# EAGLE design PGTN034_quantizer_mki_controls (EAGLE 9.6.0)
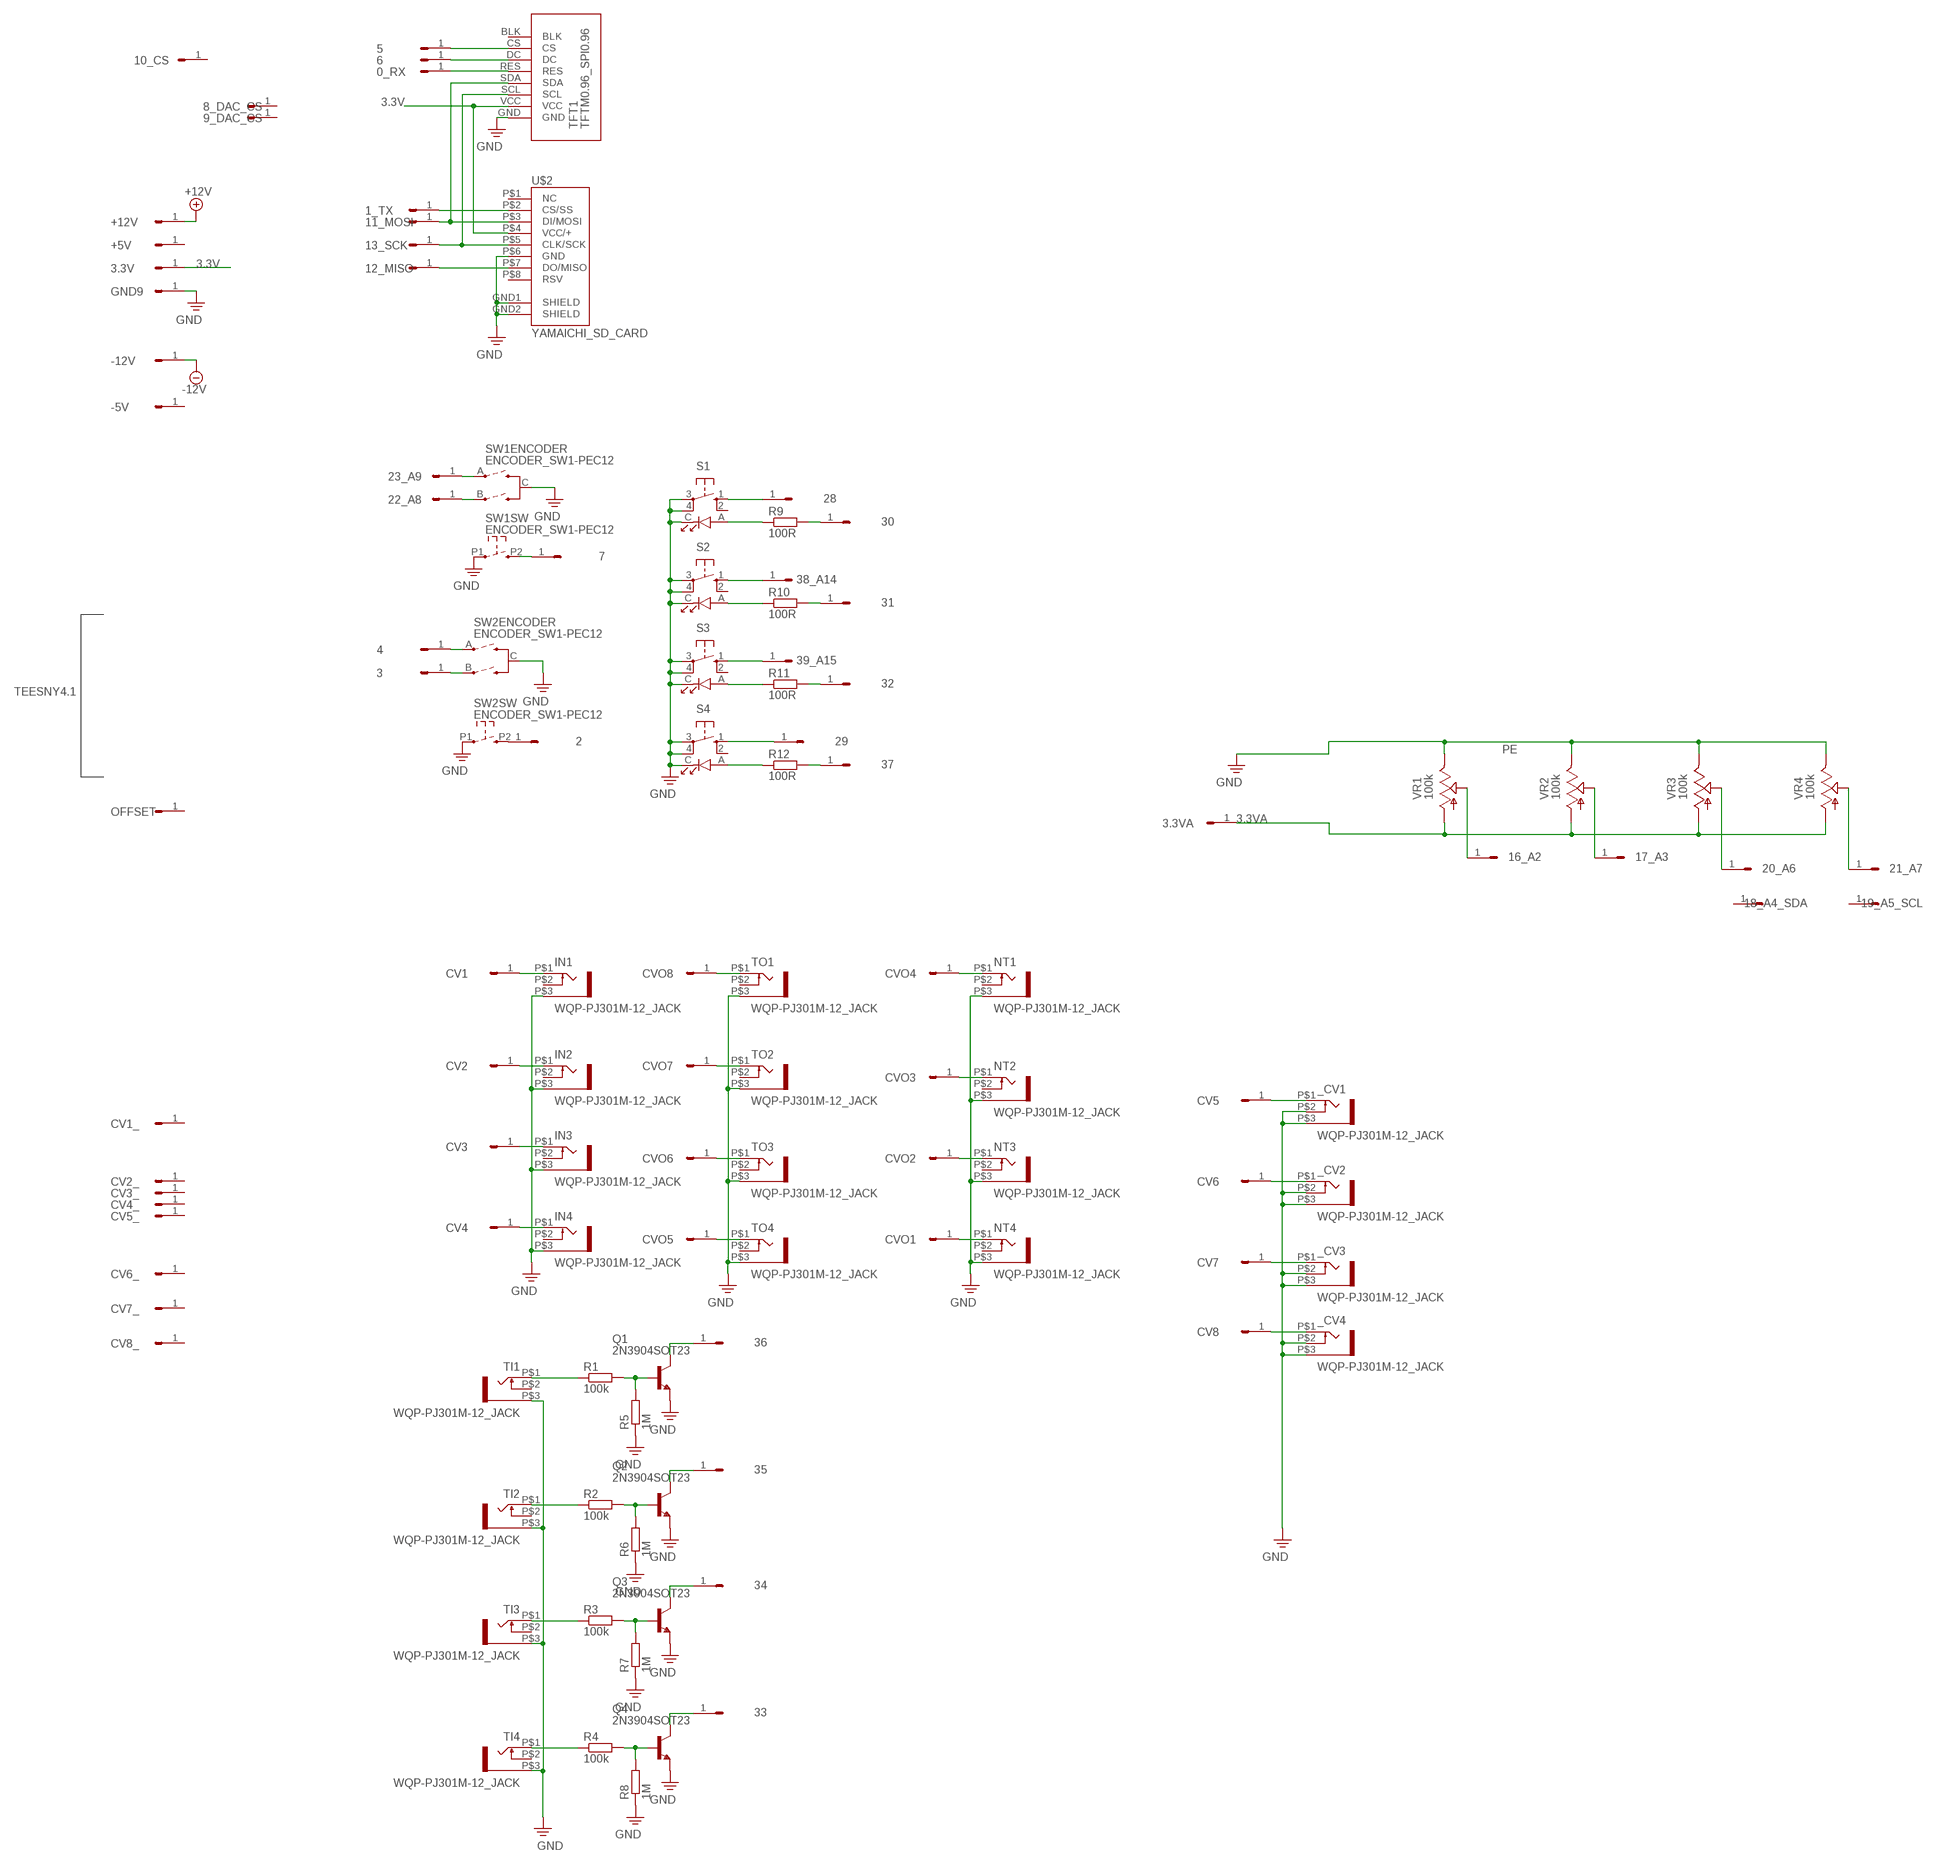
[diagram p0: schematic, sheet 1]

## Parts
0_RX  HEADER/MALE/01  [HEADER/MALE/01]
1_TX  HEADER/MALE/01  [HEADER/MALE/01]
2  HEADER/MALE/01  [HEADER/MALE/01]
3  HEADER/MALE/01  [HEADER/MALE/01]
3.3V  HEADER/MALE/01  [HEADER/MALE/01]
3.3VA  HEADER/MALE/01  [HEADER/MALE/01]
4  HEADER/MALE/01  [HEADER/MALE/01]
5  HEADER/MALE/01  [HEADER/MALE/01]
6  HEADER/MALE/01  [HEADER/MALE/01]
7  HEADER/MALE/01  [HEADER/MALE/01]
8_DAC_CS  HEADER/MALE/01  [HEADER/MALE/01]
9_DAC_CS  HEADER/MALE/01  [HEADER/MALE/01]
10_CS  HEADER/MALE/01  [HEADER/MALE/01]
11_MOSI  HEADER/MALE/01  [HEADER/MALE/01]
12_MISO  HEADER/MALE/01  [HEADER/MALE/01]
13_SCK  HEADER/MALE/01  [HEADER/MALE/01]
16_A2  HEADER/MALE/01  [HEADER/MALE/01]
17_A3  HEADER/MALE/01  [HEADER/MALE/01]
18_A4_SDA  HEADER/MALE/01  [HEADER/MALE/01]
19_A5_SCL  HEADER/MALE/01  [HEADER/MALE/01]
20_A6  HEADER/MALE/01  [HEADER/MALE/01]
21_A7  HEADER/MALE/01  [HEADER/MALE/01]
22_A8  HEADER/MALE/01  [HEADER/MALE/01]
23_A9  HEADER/MALE/01  [HEADER/MALE/01]
28  HEADER/MALE/01  [HEADER/MALE/01]
29  HEADER/MALE/01  [HEADER/MALE/01]
30  HEADER/MALE/01  [HEADER/MALE/01]
31  HEADER/MALE/01  [HEADER/MALE/01]
32  HEADER/MALE/01  [HEADER/MALE/01]
33  HEADER/MALE/01  [HEADER/MALE/01]
34  HEADER/MALE/01  [HEADER/MALE/01]
35  HEADER/MALE/01  [HEADER/MALE/01]
36  HEADER/MALE/01  [HEADER/MALE/01]
37  HEADER/MALE/01  [HEADER/MALE/01]
38_A14  HEADER/MALE/01  [HEADER/MALE/01]
39_A15  HEADER/MALE/01  [HEADER/MALE/01]
+5V  HEADER/MALE/01  [HEADER/MALE/01]
+12V  HEADER/MALE/01  [HEADER/MALE/01]
-5V  HEADER/MALE/01  [HEADER/MALE/01]
-12V  HEADER/MALE/01  [HEADER/MALE/01]
_CV1  WQP-PJ301M-12_JACK  [WQP-PJ301M-12_JACK]
_CV2  WQP-PJ301M-12_JACK  [WQP-PJ301M-12_JACK]
_CV3  WQP-PJ301M-12_JACK  [WQP-PJ301M-12_JACK]
_CV4  WQP-PJ301M-12_JACK  [WQP-PJ301M-12_JACK]
CV1  HEADER/MALE/01  [HEADER/MALE/01]
CV1_  HEADER/MALE/01  [HEADER/MALE/01]
CV2  HEADER/MALE/01  [HEADER/MALE/01]
CV2_  HEADER/MALE/01  [HEADER/MALE/01]
CV3  HEADER/MALE/01  [HEADER/MALE/01]
CV3_  HEADER/MALE/01  [HEADER/MALE/01]
CV4  HEADER/MALE/01  [HEADER/MALE/01]
CV4_  HEADER/MALE/01  [HEADER/MALE/01]
CV5  HEADER/MALE/01  [HEADER/MALE/01]
CV5_  HEADER/MALE/01  [HEADER/MALE/01]
CV6  HEADER/MALE/01  [HEADER/MALE/01]
CV6_  HEADER/MALE/01  [HEADER/MALE/01]
CV7  HEADER/MALE/01  [HEADER/MALE/01]
CV7_  HEADER/MALE/01  [HEADER/MALE/01]
CV8  HEADER/MALE/01  [HEADER/MALE/01]
CV8_  HEADER/MALE/01  [HEADER/MALE/01]
CVO1  HEADER/MALE/01  [HEADER/MALE/01]
CVO2  HEADER/MALE/01  [HEADER/MALE/01]
CVO3  HEADER/MALE/01  [HEADER/MALE/01]
CVO4  HEADER/MALE/01  [HEADER/MALE/01]
CVO5  HEADER/MALE/01  [HEADER/MALE/01]
CVO6  HEADER/MALE/01  [HEADER/MALE/01]
CVO7  HEADER/MALE/01  [HEADER/MALE/01]
CVO8  HEADER/MALE/01  [HEADER/MALE/01]
GND9  HEADER/MALE/01  [HEADER/MALE/01]
IN1  WQP-PJ301M-12_JACK  [WQP-PJ301M-12_JACK]
IN2  WQP-PJ301M-12_JACK  [WQP-PJ301M-12_JACK]
IN3  WQP-PJ301M-12_JACK  [WQP-PJ301M-12_JACK]
IN4  WQP-PJ301M-12_JACK  [WQP-PJ301M-12_JACK]
NT1  WQP-PJ301M-12_JACK  [WQP-PJ301M-12_JACK]
NT2  WQP-PJ301M-12_JACK  [WQP-PJ301M-12_JACK]
NT3  WQP-PJ301M-12_JACK  [WQP-PJ301M-12_JACK]
NT4  WQP-PJ301M-12_JACK  [WQP-PJ301M-12_JACK]
OFFSET  HEADER/MALE/01  [HEADER/MALE/01]
Q1  2N3904SOT23  [SOT23]
Q2  2N3904SOT23  [SOT23]
Q3  2N3904SOT23  [SOT23]
Q4  2N3904SOT23  [SOT23]
R1  100k  RESISTOR  [R0603]
R2  100k  RESISTOR  [R0603]
R3  100k  RESISTOR  [R0603]
R4  100k  RESISTOR  [R0603]
R5  1M  RESISTOR  [R0603]
R6  1M  RESISTOR  [R0603]
R7  1M  RESISTOR  [R0603]
R8  1M  RESISTOR  [R0603]
R9  100R  RESISTOR  [R0603]
R10  100R  RESISTOR  [R0603]
R11  100R  RESISTOR  [R0603]
R12  100R  RESISTOR  [R0603]
S1  SW-LEDTHONK  [SW-PUSH-TACT-LED-THONK]
S2  SW-LEDTHONK  [SW-PUSH-TACT-LED-THONK]
S3  SW-LEDTHONK  [SW-PUSH-TACT-LED-THONK]
S4  SW-LEDTHONK  [SW-PUSH-TACT-LED-THONK]
SW1  ENCODER_SW1-PEC12  [PEC12_INCREMENTAL_ENCODER]
SW2  ENCODER_SW1-PEC12  [PEC12_INCREMENTAL_ENCODER]
TFT1  TFTM0.96_SPI0.96  [TFTM0.96]
TI1  WQP-PJ301M-12_JACK  [WQP-PJ301M-12_JACK]
TI2  WQP-PJ301M-12_JACK  [WQP-PJ301M-12_JACK]
TI3  WQP-PJ301M-12_JACK  [WQP-PJ301M-12_JACK]
TI4  WQP-PJ301M-12_JACK  [WQP-PJ301M-12_JACK]
TO1  WQP-PJ301M-12_JACK  [WQP-PJ301M-12_JACK]
TO2  WQP-PJ301M-12_JACK  [WQP-PJ301M-12_JACK]
TO3  WQP-PJ301M-12_JACK  [WQP-PJ301M-12_JACK]
TO4  WQP-PJ301M-12_JACK  [WQP-PJ301M-12_JACK]
U$2  YAMAICHI_SD_CARD  [YAMAICHI_MICROSD_VERTICAL]
VR1  100k  9MM_SNAP-IN_POT_  [9MM_SNAP-IN_POT]
VR2  100k  9MM_SNAP-IN_POT_  [9MM_SNAP-IN_POT]
VR3  100k  9MM_SNAP-IN_POT_  [9MM_SNAP-IN_POT]
VR4  100k  9MM_SNAP-IN_POT_  [9MM_SNAP-IN_POT]

## Nets
3.3V: 3.3V.1 TFT1.VCC U$2.P$4(VCC/+)
3.3VA: 3.3VA.1 VR1.1(A) VR2.1(A) VR3.1(A) VR4.1(A)
+12V: +12V.1
-12V: -12V.1
N$1: _CV1.P$1 CV5.1
N$2: 16_A2.1 VR1.2(S)
N$3: _CV2.P$1 CV6.1
N$4: 0_RX.1 TFT1.RES
N$5: CVO1.1 NT4.P$1
N$6: CVO2.1 NT3.P$1
N$7: 17_A3.1 VR2.2(S)
N$8: CVO3.1 NT2.P$1
N$9: 20_A6.1 VR3.2(S)
N$10: 21_A7.1 VR4.2(S)
N$11: CVO4.1 NT1.P$1
N$12: CVO5.1 TO4.P$1
N$13: CVO6.1 TO3.P$1
N$14: CVO7.1 TO2.P$1
N$15: CVO8.1 TO1.P$1
N$16: CV1.1 IN1.P$1
N$17: CV2.1 IN2.P$1
N$18: CV3.1 IN3.P$1
N$19: CV4.1 IN4.P$1
N$20: _CV3.P$1 CV7.1
N$21: _CV4.P$1 CV8.1
N$22: R1.1 TI1.P$1
N$23: R2.1 TI2.P$1
N$24: R3.1 TI3.P$1
N$25: R4.1 TI4.P$1
N$26: Q1.1(B) R1.2 R5.2
N$27: Q2.1(B) R2.2 R6.2
N$28: Q3.1(B) R3.2 R7.2
N$29: Q4.1(B) R4.2 R8.2
N$30: 36.1 Q1.3(C)
N$31: 35.1 Q2.3(C)
N$32: 34.1 Q3.3(C)
N$33: 33.1 Q4.3(C)
N$34: R9.1 S1.A
N$35: R12.1 S4.A
N$36: 7.1 SW1.P2
N$37: 23_A9.1 SW1.A(ENCODER:A)
N$38: 22_A8.1 SW1.B(ENCODER:B)
N$39: R11.1 S3.A
N$40: R10.1 S2.A
N$41: 28.1 S1.1(S)
N$42: 38_A14.1 S2.1(S)
N$43: 39_A15.1 S3.1(S)
N$44: 29.1 S4.1(S)
N$45: 31.1 R10.2
N$46: 30.1 R9.2
N$47: 32.1 R11.2
N$48: 37.1 R12.2
N$49: 12_MISO.1 U$2.P$7(DO/MISO)
N$50: 11_MOSI.1 TFT1.SDA U$2.P$3(DI/MOSI)
N$51: 13_SCK.1 TFT1.SCL U$2.P$5(CLK/SCK)
N$52: 5.1 TFT1.CS
N$53: 6.1 TFT1.DC
N$54: 3.1 SW2.B(ENCODER:B)
N$55: 4.1 SW2.A(ENCODER:A)
N$56: 2.1 SW2.P2
N$57: 1_TX.1 U$2.P$2(CS/SS)
PE: _CV1.P$2 _CV1.P$3 _CV2.P$2 _CV2.P$3 _CV3.P$2 _CV3.P$3 _CV4.P$2 _CV4.P$3 GND9.1 IN1.P$3 IN2.P$3 IN3.P$3 IN4.P$3 NT1.P$3 NT2.P$3 NT3.P$3 NT4.P$3 Q1.2(E) Q2.2(E) Q3.2(E) Q4.2(E) R5.1 R6.1 R7.1 R8.1 S1.3(P) S1.4(P1) S1.C S2.3(P) S2.4(P1) S2.C S3.3(P) S3.4(P1) S3.C S4.3(P) S4.4(P1) S4.C SW1.C(ENCODER:C) SW1.P1 SW2.C(ENCODER:C) SW2.P1 TFT1.GND TI1.P$3 TI2.P$3 TI3.P$3 TI4.P$3 TO1.P$3 TO2.P$3 TO3.P$3 TO4.P$3 U$2.GND1(SHIELD) U$2.GND2(SHIELD) U$2.P$6(GND) VR1.3(E) VR2.3(E) VR3.3(E) VR4.3(E) ; supply symbol labelled GND
Unconnected: 8_DAC_CS.1 9_DAC_CS.1 10_CS.1 18_A4_SDA.1 19_A5_SCL.1 +5V.1 -5V.1 CV1_.1 CV2_.1 CV3_.1 CV4_.1 CV5_.1 CV6_.1 CV7_.1 CV8_.1 IN1.P$2 IN2.P$2 IN3.P$2 IN4.P$2 NT1.P$2 NT2.P$2 NT3.P$2 NT4.P$2 OFFSET.1 S1.2(S1) S2.2(S1) S3.2(S1) S4.2(S1) TFT1.BLK TI1.P$2 TI2.P$2 TI3.P$2 TI4.P$2 TO1.P$2 TO2.P$2 TO3.P$2 TO4.P$2 U$2.P$1(NC) U$2.P$8(RSV)

## Notes on the sheet
- TEESNY4.1

## Library data of the parts
0_RX 1_TX 2 3 3.3V 3.3VA 4-7 8_DAC_CS 9_DAC_CS 10_CS 11_MOSI 12_MISO 13_SCK 16_A2 17_A3 18_A4_SDA 19_A5_SCL 20_A6 21_A7 22_A8 23_A9 28-37 38_A14 39_A15 +5V +12V -5V -12V CV1 CV1_ CV2 CV2_ CV3 CV3_ CV4 CV4_ CV5 CV5_ CV6 CV6_ CV7 CV7_ CV8 CV8_ CVO1-CVO8 GND9 OFFSET = connectors:HEADER/MALE/01; SPICEPREFIX: X
_CV1-_CV4 IN1-IN4 NT1-NT4 TO1-TO4 = controls:WQP-PJ301M-12_JACK
Q1-Q4 = transistors:2N3904: NPN Transistor
R1-R12 = resistors:RESISTOR: RESISTOR, European symbol
S1-S4 = controls:SW-LED: Illuminated Switch
SW1 SW2 = controls:ENCODER_SW1: Incremental Encoder with push switch
TFT1 = display:TFTM0.96_SPI
TI1-TI4 = controls:WQP-PJ301M-12_JACK; SPICEPREFIX: J
U$2 = controls:YAMAICHI_SD_CARD: Vertical SD Card Holder
VR1-VR4 = controls:9MM_SNAP-IN_POT: 9mm vertical snap-in pot, Alpha / Panasonic style

## Board
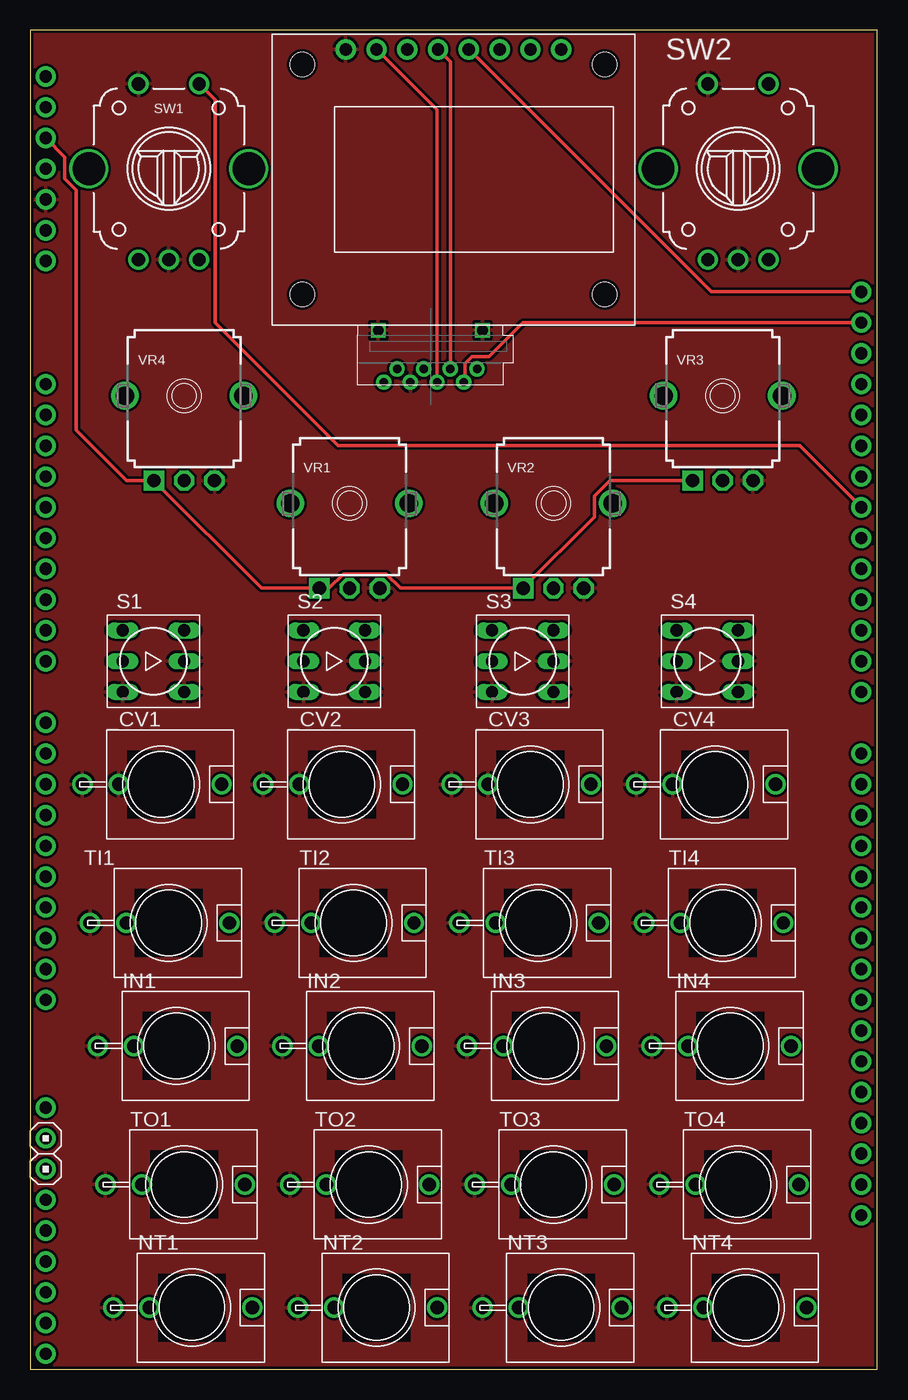
[diagram p1: board, top side]
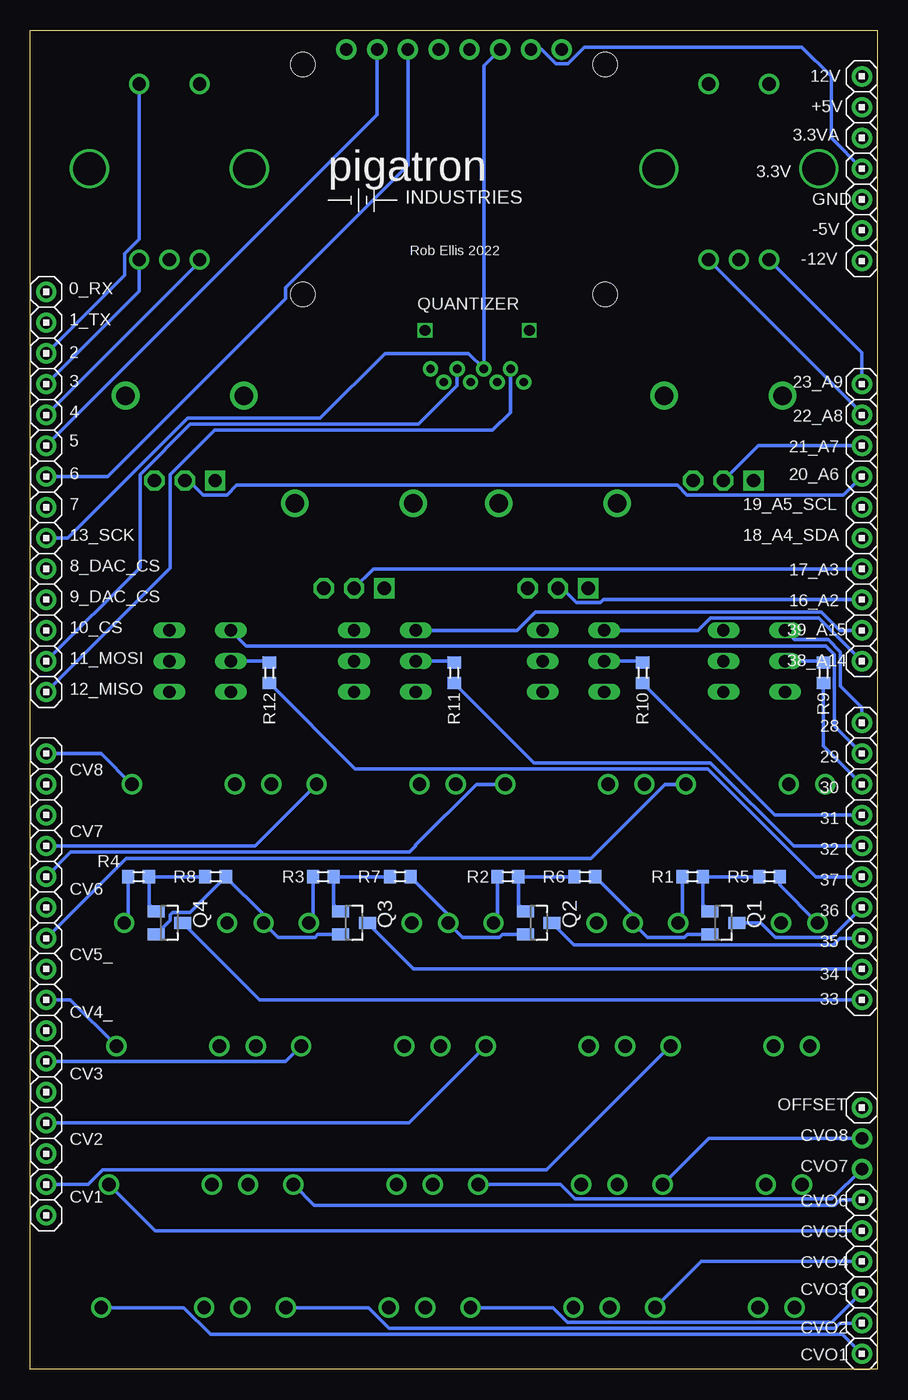
[diagram p2: board, bottom side, seen from below]

Size 69.9 x 110.48 mm. Coordinates in mm from the lower left corner, seen from the top.
Outline: 0,0 69.9,0 69.9,110.48 0,110.48 0,0
Copper layers (1*16): Top 0.0356mm / dielectric 1.5011mm / Bottom 0.0356mm
Design rules "pigatron *": minimum track width 8mil, minimum drill 13mil, track to track 8mil, track to pad 8mil, pad to pad 8mil, via to via 8mil, smd to smd 6mil, copper to edge 10mil, drill to drill 10mil, minimum pad ring 6mil, minimum via ring 10mil, stop-mask expansion 4mil, vias tented up to drill 15mil, thermal gap 10mil

### Footprints (pad centres in the part's own frame; a part is rotated, then mirrored left to right if it is on the bottom)
HEADER/MALE/01 = drill 1.016 pad 1.676: 1 0,0
WQP-PJ301M-12_JACK = drill 1.1 pad 1.676: P$1 0,5; P$2 0,-3.5; P$3 0,-6.5
SOT23 = smd 1 x 1.4: 1 -0.95,-1.1; 2 0.95,-1.1; 3 0,1.1
R0603 = smd 1 x 1.1: 1 -0.85,0; 2 0.85,0
SW-PUSH-TACT-LED-THONK = drill 1.016 long: 1 -2.54,2.54; 2 2.54,2.54; 3 -2.54,-2.54; 4 2.54,-2.54; A -2.54,0; C 2.54,0
PEC12_INCREMENTAL_ENCODER = drill 1.1 pad 1.676: A -2.5,-7.5; B 2.5,-7.5; C 0,-7.5; P1 -2.5,7; P2 2.5,7 | drill 2.692: GND@1 -6.6,0; GND@2 6.6,0
TFTM0.96 = drill 1.016 pad 1.676: BLK 8.89,-1.27; CS 6.35,-1.27; DC 3.81,-1.27; GND -8.89,-1.27; RES 1.27,-1.27; SCL -3.81,-1.27; SDA -1.27,-1.27; VCC -6.35,-1.27 | hole 2.007: -12.484,-21.501; 12.484,-21.501; -12.484,-2.502; 12.484,-2.502
YAMAICHI_MICROSD_VERTICAL = drill 0.9 square: GND1 -4.3,-3.17; GND2 4.3,-3.17 | drill 0.7 pad 1.27: P$1 -3.85,0; P$2 -2.75,1.1; P$3 -1.65,0; P$4 -0.55,1.1; P$5 0.55,0; P$6 1.65,1.1; P$7 2.75,0; P$8 3.85,1.1
9MM_SNAP-IN_POT = drill 1.1 pad 1.676 square: 1 -2.5,-7 | drill 1.1 pad 1.676 octagon: 2 0,-7; 3 2.5,-7 | drill 1.524 pad 2.286: CHASSIS1 -4.881,0; CHASSIS2 4.881,0

### Placement (x,y rotation side)
0_RX  68.58,88.9 0 bottom
1_TX  68.58,86.36 0 bottom
2  68.58,83.82 0 bottom
3  68.58,81.28 0 bottom
3.3V  1.27,99.06 90 bottom
3.3VA  1.27,101.6 0 bottom
4  68.58,78.74 0 bottom
5  68.58,76.2 0 bottom
6  68.58,73.66 0 bottom
7  68.58,71.12 0 bottom
8_DAC_CS  68.58,66.04 0 bottom
9_DAC_CS  68.58,63.5 0 bottom
10_CS  68.58,60.96 0 bottom
11_MOSI  68.58,58.42 0 bottom
12_MISO  68.58,55.88 0 bottom
13_SCK  68.58,68.58 0 bottom
16_A2  1.27,63.5 180 bottom
17_A3  1.27,66.04 180 bottom
18_A4_SDA  1.27,68.58 0 bottom
19_A5_SCL  1.27,71.12 0 bottom
20_A6  1.27,73.66 0 bottom
21_A7  1.27,76.2 0 bottom
22_A8  1.27,78.74 0 bottom
23_A9  1.27,81.28 0 bottom
28  1.27,53.34 180 bottom
29  1.27,50.8 180 bottom
30  1.27,48.26 180 bottom
31  1.27,45.72 180 bottom
32  1.27,43.18 180 bottom
33  1.27,30.48 180 bottom
34  1.27,33.02 180 bottom
35  1.27,35.56 180 bottom
36  1.27,38.1 180 bottom
37  1.27,40.64 180 bottom
38_A14  1.27,58.42 180 bottom
39_A15  1.27,60.96 180 bottom
+5V  1.27,104.14 180 bottom
+12V  1.27,106.68 0 bottom
-5V  1.27,93.98 0 bottom
-12V  1.27,91.44 0 bottom
_CV1  10.79,48.26 270 top
_CV2  25.72,48.26 270 top
_CV3  41.27,48.26 270 top
_CV4  56.52,48.26 270 top
CV1  68.58,15.24 0 bottom
CV1_  68.58,12.7 0 bottom
CV2  68.58,20.32 0 bottom
CV2_  68.58,17.78 0 bottom
CV3  68.58,25.4 0 bottom
CV3_  68.58,22.86 0 bottom
CV4  68.58,30.48 0 bottom
CV4_  68.58,27.94 0 bottom
CV5  68.58,35.56 180 bottom
CV5_  68.58,33.02 180 bottom
CV6  68.58,40.64 180 bottom
CV6_  68.58,38.1 180 bottom
CV7  68.58,43.18 180 bottom
CV7_  68.58,45.72 180 bottom
CV8  68.58,50.8 180 bottom
CV8_  68.58,48.26 180 bottom
CVO1  1.27,1.27 0 bottom
CVO2  1.27,3.81 0 bottom
CVO3  1.27,6.35 0 bottom
CVO4  1.27,8.89 0 bottom
CVO5  1.27,11.43 0 bottom
CVO6  1.27,13.97 0 bottom
CVO7  1.27,16.51 0 top
CVO8  1.27,19.05 0 top
GND9  1.27,96.52 0 bottom
IN1  12.06,26.67 270 top
IN2  27.3,26.67 270 top
IN3  42.55,26.67 270 top
IN4  57.78,26.67 270 top
NT1  13.34,5.08 270 top
NT2  28.57,5.08 270 top
NT3  43.81,5.08 270 top
NT4  59.05,5.08 270 top
OFFSET  1.27,21.59 0 bottom
Q1  12.7,36.83 270 bottom
Q2  27.94,36.83 270 bottom
Q3  43.18,36.83 270 bottom
Q4  58.42,36.83 270 bottom
R1  15.24,40.64 0 bottom
R2  30.48,40.64 0 bottom
R3  45.72,40.64 0 bottom
R4  60.96,40.64 0 bottom
R5  8.89,40.64 180 bottom
R6  24.13,40.64 180 bottom
R7  39.37,40.64 180 bottom
R8  54.61,40.64 180 bottom
R9  4.45,57.47 270 bottom
R10  19.37,57.47 270 bottom
R11  34.92,57.47 270 bottom
R12  50.16,57.47 270 bottom
S1  10.16,58.42 0 top
S2  25.08,58.42 0 top
S3  40.64,58.42 0 top
S4  55.88,58.42 0 top
SW1  11.43,99.06 0 top
SW2  58.42,99.06 0 top
TFT1  34.92,110.17 0 top
TI1  11.43,36.83 270 top
TI2  26.67,36.83 270 top
TI3  41.91,36.83 270 top
TI4  57.15,36.83 270 top
TO1  12.7,15.24 270 top
TO2  27.94,15.24 270 top
TO3  43.18,15.24 270 top
TO4  58.42,15.24 270 top
U$1  [PIGATRON-LOGO]  36.45,98.04 0 bottom
U$2  33.02,82.55 180 top
VR1  26.35,71.44 0 top
VR2  43.18,71.44 0 top
VR3  57.15,80.33 0 top
VR4  12.7,80.33 0 top

### Tracks (layer width: path | path; a pad name or v marks a point on that pad's centre or on a via)
3.3V
  Top 0.305: TFT1.VCC 33.57,103.91 U$2.P$4
  Bottom 0.305: 3.3V.1 3.81,101.6 3.81,106.68 6.21,109.08 24.17,109.08 25.54,107.71 26.53,107.71 27.72,108.9 TFT1.VCC
3.3VA
  Top 0.305: 3.3VA.1 2.86,100.01 2.86,98.24 3.81,97.29 3.81,77.47 7.95,73.33 VR4.1 19.09,64.44 VR1.1 24.66,64.44 25.86,65.63 29.35,65.63 30.54,64.44 VR2.1 46.56,70.32 46.56,72.06 47.83,73.33 VR3.1
N$1
  Bottom 0.305: CV5.1 61.98,42.16 23.62,42.16 17.53,48.26 _CV1.P$1
N$2
  Bottom 0.305: VR1.2 26.03,64.44 24.84,63.24 22.87,63.24 22.61,63.5 16_A2.1
N$3
  Bottom 0.305: CV6.1 66.55,42.67 38.61,42.67 38.1,43.18 38.1,43.25 33.09,48.26 _CV2.P$1
N$4
  Top 0.305: 0_RX.1 56.2,88.9 TFT1.RES
N$5
  Bottom 0.305: NT4.P$1 57.24,5.08 55.03,2.87 2.87,2.87 CVO1.1
N$6
  Bottom 0.305: NT3.P$1 42,5.08 40.3,3.38 3.52,3.38 3.09,3.81 CVO2.1
N$7
  Bottom 0.305: VR2.2 41.58,66.04 17_A3.1
N$8
  Bottom 0.305: NT2.P$1 26.76,5.08 25.57,3.89 3.73,3.89 CVO3.1
N$9
  Bottom 0.305: VR3.2 56.83,73.33 55.63,72.13 53.66,72.13 52.86,72.94 16.5,72.94 15.69,72.13 2.8,72.13 20_A6.1
N$10
  Bottom 0.305: VR4.2 9.83,76.2 21_A7.1
N$11
  Bottom 0.305: NT1.P$1 14.53,8.89 CVO4.1
N$12
  Bottom 0.305: TO4.P$1 59.61,11.43 CVO5.1
N$13
  Bottom 0.305: CVO6.1 3.09,13.97 3.52,13.54 46.48,13.54 TO3.P$1
N$14
  Bottom 0.305: TO2.P$1 26.13,15.24 24.93,14.05 3.73,14.05 CVO7.1
N$15
  Bottom 0.305: TO1.P$1 13.89,19.05 CVO8.1
N$16
  Bottom 0.305: CV1.1 65.11,15.24 63.91,16.43 27.3,16.43 IN1.P$1
N$17
  Bottom 0.305: IN2.P$1 38.66,20.32 CV2.1
N$18
  Bottom 0.305: IN3.P$1 48.81,25.4 CV3.1
N$19
  Bottom 0.305: IN4.P$1 66.59,30.48 CV4.1
N$20
  Bottom 0.305: _CV3.P$1 51.35,43.18 CV7.1
N$21
  Bottom 0.305: _CV4.P$1 64.06,50.8 CV8.1
N$22
  Bottom 0.305: R1.1 16.09,37.17 TI1.P$1
N$23
  Bottom 0.305: R2.1 31.33,37.17 TI2.P$1
N$24
  Bottom 0.305: R3.1 46.57,37.17 TI3.P$1
N$25
  Bottom 0.305: R4.1 61.81,37.17 TI4.P$1
N$26
  Bottom 0.305: R5.2 R1.2 14.39,38.37 Q1.1
N$27
  Bottom 0.305: R6.2 R2.2 29.63,38.37 Q2.1
N$28
  Bottom 0.305: R7.2 R3.2 44.87,38.37 Q3.1
N$29
  Bottom 0.305: R8.2 R4.2 60.11,38.37 Q4.1
N$30
  Bottom 0.305: Q1.3 9.62,36.83 8.42,35.64 3.73,35.64 36.1
N$31
  Bottom 0.305: 35.1 3.09,35.56 3.63,35.02 25.03,35.02 Q2.3
N$32
  Bottom 0.305: Q3.3 38.27,33.02 34.1
N$33
  Bottom 0.305: Q4.3 50.97,30.48 33.1
N$34
  Bottom 0.305: R9.1 4.55,58.42 S1.A
N$35
  Bottom 0.305: R12.1 50.27,58.42 S4.A
N$36
  Top 0.305: SW1.P2 15.24,104.75 15.24,86.36 25.4,76.2 63.5,76.2 7.1
N$37
  Bottom 0.305: 23_A9.1 1.27,83.9 SW1.A
N$38
  Bottom 0.305: 22_A8.1 1.27,78.9 SW1.B
N$39
  Bottom 0.305: R11.1 35.03,58.42 S3.A
N$40
  Bottom 0.305: R10.1 19.47,58.42 S2.A
N$41
  Bottom 0.305: 28.1 1.27,54.61 3.03,56.37 3.03,59.17 4.05,60.2 6.86,60.2 S1.1
N$42
  Bottom 0.305: S2.1 14.8,60.96 13.78,61.98 4.83,61.98 38_A14.1
N$43
  Bottom 0.305: 39_A15.1 3.09,60.96 4.62,62.48 28.2,62.48 29.72,60.96 S3.1
N$44
  Bottom 0.305: S4.1 52.07,59.69 4.26,59.69 3.54,58.97 3.54,53.07 29.1
N$45
  Bottom 0.305: R10.2 8.47,45.72 31.1
N$46
  Bottom 0.305: R9.2 4.45,51.44 30.1
N$47
  Bottom 0.305: R11.2 28.35,50.04 13.76,50.04 6.9,43.18 32.1
N$48
  Bottom 0.305: R12.2 43.08,49.53 13.97,49.53 5.08,40.64 37.1
N$49
  Bottom 0.305: 12_MISO.1 58.34,66.12 58.34,73.82 54.7,77.47 31.75,77.47 30.27,78.95 U$2.P$7
N$50
  Top 0.305: U$2.P$3 34.67,107.89 TFT1.SDA
  Bottom 0.305: 11_MOSI.1 60.84,66.16 60.84,73.82 56.69,77.98 37.84,77.98 34.67,81.15 U$2.P$3
N$51
  Bottom 0.305: 13_SCK.1 66.8,68.58 56.9,78.49 45.97,78.49 40.64,83.82 33.74,83.82 U$2.P$5 32.47,107.55 TFT1.SCL
N$52
  Bottom 0.305: 5.1 41.27,103.5 TFT1.CS
N$53
  Bottom 0.305: 6.1 63.5,73.66 48.82,88.34 48.82,89.25 38.73,99.34 TFT1.DC
N$54
  Bottom 0.305: 3.1 60.92,88.94 SW2.B
N$55
  Bottom 0.305: 4.1 55.92,91.4 SW2.A
N$56
  Bottom 0.305: 2.1 62.11,90.29 62.11,92.05 60.92,93.25 SW2.P2
N$57
  Top 0.305: 1_TX.1 40.68,86.36 37.86,83.54 36.46,83.54 35.88,82.96 35.88,81.56 U$2.P$2
PE
  Bottom 0.305: TI1.P$3 8.04,39.94 R5.1 | Q1.2 15.69,35.88 15.94,35.64 18.98,35.64 TI2.P$3 20.17,37.53 R6.1 | Q2.2 30.93,35.88 31.18,35.64 34.22,35.64 TI3.P$3 35.41,37.53 R7.1 | Q3.2 46.17,35.88 46.42,35.64 49.46,35.64 TI4.P$3 50.65,37.53 R8.1 56.71,37.69 58.17,37.69 58.38,37.48 58.38,37.02 Q4.2
  pour Top: 69.85,110.49 0,110.49 0,0 69.85,0

### Text on the board
bNames: 12V | GND | Rob Ellis 2022 | -12V | QUANTIZER
bValues: 74AHCT1G125